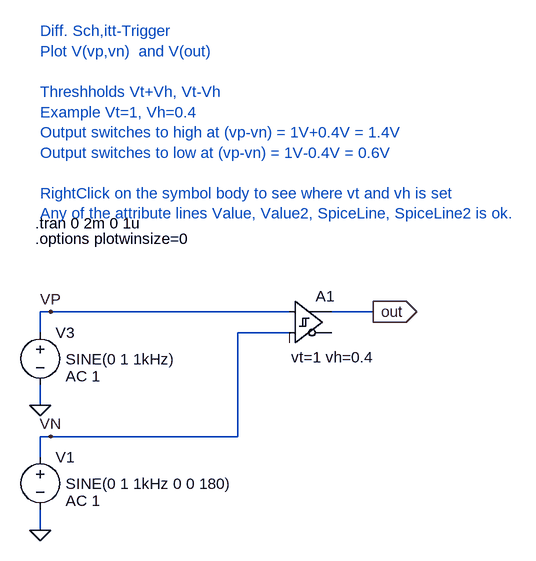
[diagram p0: schematic Diff_Schmitt.asc]
Diff_Schmitt.asc, the LTspice schematic file:
Version 4
SHEET 1 1208 904
WIRE -272 224 -272 192
WIRE -272 336 -272 304
WIRE -272 416 -272 384
WIRE -272 528 -272 496
WIRE -256 192 -272 192
WIRE -256 384 -272 384
WIRE 32 384 -256 384
WIRE 32 384 32 224
WIRE 112 192 -256 192
WIRE 112 224 32 224
WIRE 240 192 176 192
FLAG -256 192 VP
FLAG -272 336 0
FLAG -256 384 VN
FLAG -272 528 0
FLAG 240 192 out
IOPIN 240 192 Out
SYMBOL voltage -272 208 R0
WINDOW 3 39 57 Left 0
WINDOW 123 39 83 Left 0
WINDOW 39 24 44 Left 0
SYMATTR Value SINE(0 1 1kHz)
SYMATTR Value2 AC 1
SYMATTR InstName V3
SYMBOL Digital\\diffschmitt 112 144 R0
WINDOW 123 2 118 Left 0
SYMATTR InstName A1
SYMATTR Value2 vt=1 vh=0.4
SYMBOL voltage -272 400 R0
WINDOW 3 39 57 Left 0
WINDOW 123 39 83 Left 0
WINDOW 39 24 44 Left 0
SYMATTR Value SINE(0 1 1kHz 0 0 180)
SYMATTR Value2 AC 1
SYMATTR InstName V1
TEXT -280 56 Left 0 !.tran 0 2m 0 1u
TEXT -280 80 Left 0 !.options plotwinsize=0
TEXT -272 -240 Left 0 ;Diff. Sch,itt-Trigger\nPlot V(vp,vn)  and V(out)\n \nThreshholds Vt+Vh, Vt-Vh\nExample Vt=1, Vh=0.4\nOutput switches to high at (vp-vn) = 1V+0.4V = 1.4V\nOutput switches to low at (vp-vn) = 1V-0.4V = 0.6V\n \nRightClick on the symbol body to see where vt and vh is set\nAny of the attribute lines Value, Value2, SpiceLine, SpiceLine2 is ok.

The netlist it stands for:
* Diff_Schmitt.asc
V3 VP 0 SINE(0 1 1kHz) AC 1
A1 VP VN 0 0 0 0 out 0 SCHMITT vt=1 vh=0.4
V1 VN 0 SINE(0 1 1kHz 0 0 180) AC 1
.tran 0 2m 0 1u
.options plotwinsize=0
* Diff. Sch,itt-Trigger
* Plot V(vp,vn)  and V(out)
* Threshholds Vt+Vh, Vt-Vh
* Example Vt=1, Vh=0.4
* Output switches to high at (vp-vn) = 1V+0.4V = 1.4V
* Output switches to low at (vp-vn) = 1V-0.4V = 0.6V
* RightClick on the symbol body to see where vt and vh is set
* Any of the attribute lines Value, Value2, SpiceLine, SpiceLine2 is ok.
.backanno
.end